# EAGLE design GPS Pro Mini Shield (EAGLE 7.6.0)
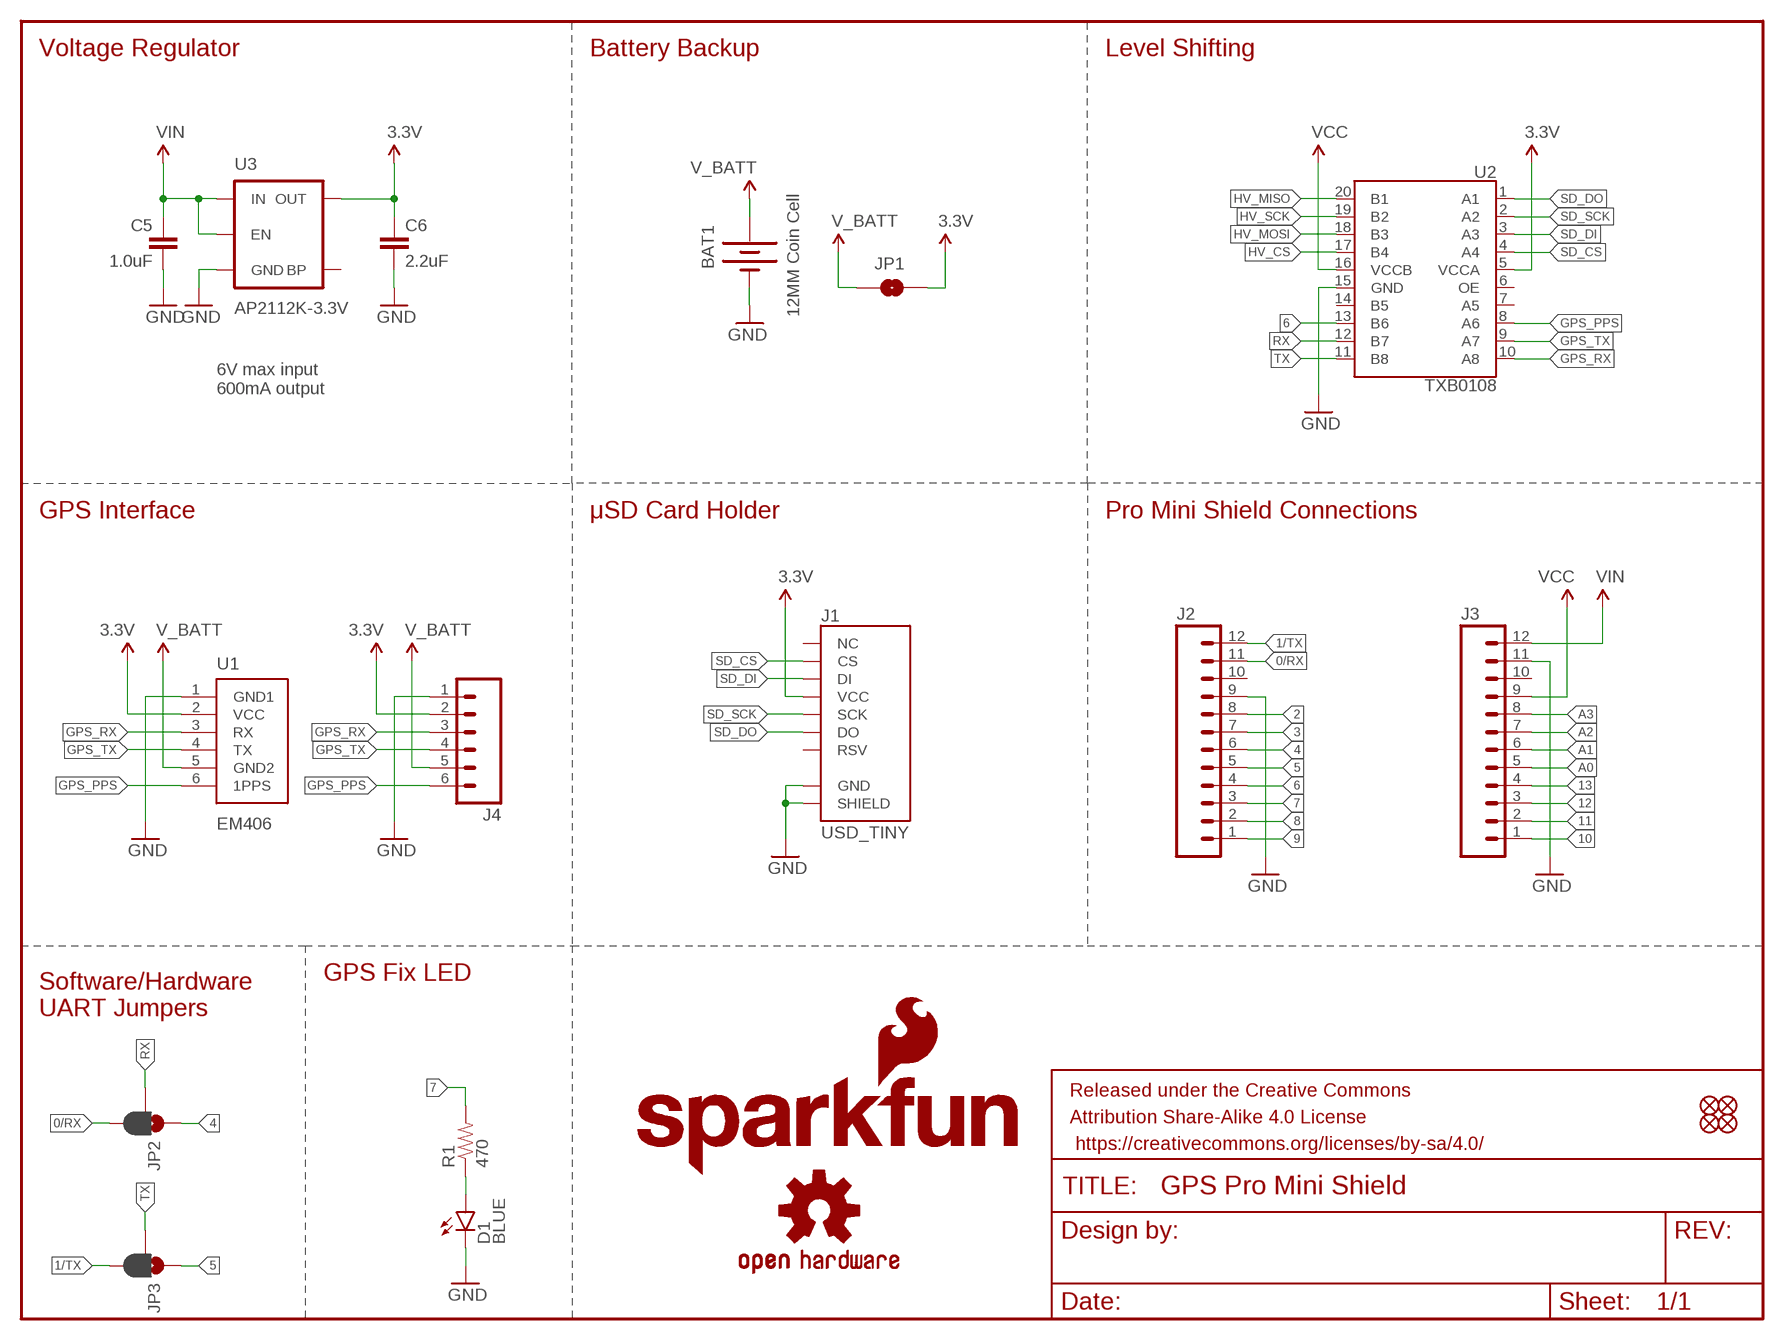
[diagram p0: schematic, sheet 1]

## Parts
BAT1  12MM Coin Cell  BATTERY12MM  [BATTCON_12MM]
C5  1.0uF  1.0UF-25V-+80/-20(0805)"  [0805-CAP]
C6  2.2uF  2.2UF-10V-20%(0603)  [0603-CAP]
D1  BLUE  LED-BLUE0603  [LED-0603]
FD1  FIDUCIALUFIDUCIAL  [MICRO-FIDUCIAL]
FD2  FIDUCIALUFIDUCIAL  [MICRO-FIDUCIAL]
FD3  FIDUCIALUFIDUCIAL  [MICRO-FIDUCIAL]
FD4  FIDUCIALUFIDUCIAL  [MICRO-FIDUCIAL]
FRAME1  FRAME-LETTER  [CREATIVE_COMMONS]
J1  USD_TINY  [SLIM_USD]
J2  M12NO_SILK  [1X12_NO_SILK]
J3  M12NO_SILK  [1X12_NO_SILK]
J4  M06NO_SILK_FEMALE_PTH  [1X06_NO_SILK]
JP1  JUMPER-PAD-2-NOYES_SILK  [PAD-JUMPER-2-NO_YES_SILK]
JP2  JUMPER-PAD-3-2OF3_NC_BY_PASTE  [PAD-JUMPER-3-2OF3_NC_BY_PASTE_YES_SILK_FULL_BOX]
JP3  JUMPER-PAD-3-2OF3_NC_BY_PASTE  [PAD-JUMPER-3-2OF3_NC_BY_PASTE_YES_SILK_FULL_BOX]
LOGO1  OSHW-LOGOS  [OSHW-LOGO-S]
LOGO3  SFE_LOGO_FLAME.1_INCH  [SFE_LOGO_FLAME_.1]
LOGO4  SFE_LOGO_NAME.1_INCH  [SFE_LOGO_NAME_.1]
R1  470  470OHM1/10W1%(0603)  [0603-RES]
U1  EM406  [EM406]
U2  TXB0108  [UFDFN-20]
U3  AP2112K-3.3V  V_REG_LDOSMD  [SOT23-5]

## Nets
0/RX: J2.11 JP2.3
1/TX: J2.12 JP3.3
2: J2.8
3: J2.7
3.3V: C6.1 J1.4(VCC) J4.2 JP1.2 U1.2(VCC) U2.5(VCCA) U3.5(OUT)
4: J2.6 JP2.1
5: J2.5 JP3.1
6: J2.4 U2.13(B6)
7: J2.3 R1.2
8: J2.2
9: J2.1
10: J3.1
11: J3.2
12: J3.3
13: J3.4
A0: J3.5
A1: J3.6
A2: J3.7
A3: J3.8
GND: BAT1.GND(-) C5.2 C6.2 D1.C J1.6(GND) J1.GND1(SHIELD) J1.GND2(SHIELD) J1.GND3(SHIELD) J1.GND4(SHIELD) J1.GND5(SHIELD) J1.GND6(SHIELD) J2.9 J3.11 J4.1 U1.1(GND1) U2.15(GND) U3.2(GND)
GPS_PPS: J4.6 U1.6(1PPS) U2.8(A6)
GPS_RX: J4.3 U1.3(RX) U2.10(A8)
GPS_TX: J4.4 U1.4(TX) U2.9(A7)
HV_CS: U2.17(B4)
HV_MISO: U2.20(B1)
HV_MOSI: U2.18(B3)
HV_SCK: U2.19(B2)
N$1: D1.A R1.1
RX: JP2.2 U2.12(B7)
SD_CS: J1.2(CS) U2.4(A4)
SD_DI: J1.3(DI) U2.3(A3)
SD_DO: J1.7(DO) U2.1(A1)
SD_SCK: J1.5(SCK) U2.2(A2)
TX: JP3.2 U2.11(B8)
V_BATT: BAT1.PWR@1(+) J4.5 JP1.1 U1.5(GND2)
VCC: J3.9 U2.16(VCCB)
VIN: C5.1 J3.12 U3.1(IN) U3.3(EN)
Unconnected: J1.1(RSV) J1.8(RSV) J1.9(NC) J2.10 J3.10 U2.6(OE) U2.7(A5) U2.14(B5) U3.4(BP)

## Notes on the sheet
- Voltage Regulator | Battery Backup | Level Shifting
- 6V max input
  600mA output
- GPS Interface | μSD Card Holder | Pro Mini Shield Connections
- GPS Fix LED
- Software/Hardware
  UART Jumpers

## Library data of the parts
BAT1 = SparkFun-Electromechanical:BATTERY: Battery Holders Various common sizes : AA, AAA, 18650 (PRT-12895), 20mm coin cell and 12mm coin cell. 20MM_4LEGS, BATT-10373; PROD_ID: BATT-08044
C5 = SparkFun-Capacitors:1.0UF-25V-+80/-20(0805): CAP-11625; PROD_ID: CAP-11625
C6 = SparkFun-Capacitors:2.2UF-10V-20%(0603): CAP-07888; PROD_ID: CAP-07888
D1 = SparkFun-LED:LED-BLUE: Blue LEDs for production use Various blue LEDs stocked by SparkFun production 0603 - DIO-08575 Rebel - DIO-09553 1206 - DIO-09911; PROD_ID: DIO-08575
FD1-FD4 = SparkFun-Aesthetics:FIDUCIAL: Fiducial Alignment Points Various fiducial points for machine vision alignment.
FRAME1 = SparkFun-Aesthetics:FRAME-LETTER: Schematic Frame Standard 8.5x11 US Letter frame
J1 = uSD Socket temp:USD_TINY
J2 J3 = SparkFun-Connectors:M12: Header 12 Standard 12-pin 0.1" header. Use with straight break away headers (SKU : PRT-00116), right angle break away headers (PRT-00553), swiss pins (PRT-00743), machine pins (PRT-00117), and female headers (PRT-00115).
J4 = SparkFun-Connectors:M06: Header 6 Standard 6-pin 0.1" header. Use with straight break away headers (SKU : PRT-00116), right angle break away headers (PRT-00553), swiss pins (PRT-00743), machine pins (PRT-00117), and female headers (PRT-00115). Molex polarized connector foot print use with SKU : PRT-08094 with associated crimp pins and housings. NOTES ON THE VARIANTS LOCK and LOCK_LONGPADS... This footprint was designed to help hold the alignment of a through-hole component (i.e. 6-pin header) while soldering it into place. You may notice that each hole has been shifted either up or down by 0.005 of an inch from it's more standard position (which is a perfectly straight line). This slight alteration caused the pins (the squares in the middle) to touch the edges of the holes. Because they are alternating, it causes a "brace" to hold the component in place. 0.005 has proven to be the perfect amount of "off-center" position when using our standard breakaway headers. Although looks a little odd when you look at the bare footprint, once you have a header in there, the alteration is very hard to notice. Also,if you push a header all the way into place, it is covered up entirely on the bottom side. This idea of altering the position of holes to aid alignment will be further integrated into the Sparkfun Library for other footprints. It can help hold any component with 3 or more connection pins.; PROD_ID: CONN-08437
JP1 = SparkFun-Passives:JUMPER-PAD-2-NO
JP2 JP3 = SparkFun-Passives:JUMPER-PAD-3-2OF3_NC_BY_PASTE
LOGO1 = SparkFun-Aesthetics:OSHW-LOGO: Open Source Hardware Logo This logo indicates the piece of hardware it is found on incorporates a OSHW license and/or adheres to the definition of open source hardware found here: http://freedomdefined.org/OSHW
LOGO3 = SparkFun-Aesthetics:SFE_LOGO_FLAME: SFE Logo, flame only This is the SparkFun flame logo. The logo on the schematic will always be the same size; the package variant is the height of the flame. Default layer for the logo on the board is tSilk.
LOGO4 = SparkFun-Aesthetics:SFE_LOGO_NAME: SFE Logo, name only This is the SparkFun name logo. The logo on the schematic will always be the same size; the package variant is the height of the flame part of the logo (or the height the flame would be, if it were drawn). Default layer for the logo on the board is tSilk.
R1 = SparkFun-Resistors:470OHM1/10W1%(0603): RES-07869; PROD_ID: RES-07869
U1 = SparkFun-Connectors:EM406: EM406 GPS Connector Proven layout and schematic for EM406 connector. Spark Fun Electronics SKU : GPS-00579
U2 = SparkFun-DigitalIC:TXB0108: 8-Bit Bi-Directional Level Shifter 1.2V-3.6V (VCCA) to 1.65V-5.5V (VCCB) bi-directional level shifter with auto direction sensing. Max data rate - VCCA 1.2V: 20Mbps (50ns), VCCA 3.3V: 100Mbps (10ns) Digikey: 296-27217-1-ND (20-UFDFN) IC-12292; PROD_ID: IC-12292
U3 = SparkFun-PowerIC:V_REG_LDO: Voltage Regulator LDO Standard 150mA LDO voltage regulator in SOT-23 layout. Micrel part MIC5205. BP (by-pass) pin is used to lower output noise with 470pF cap.; PROD_ID: VREG-12457

## Board
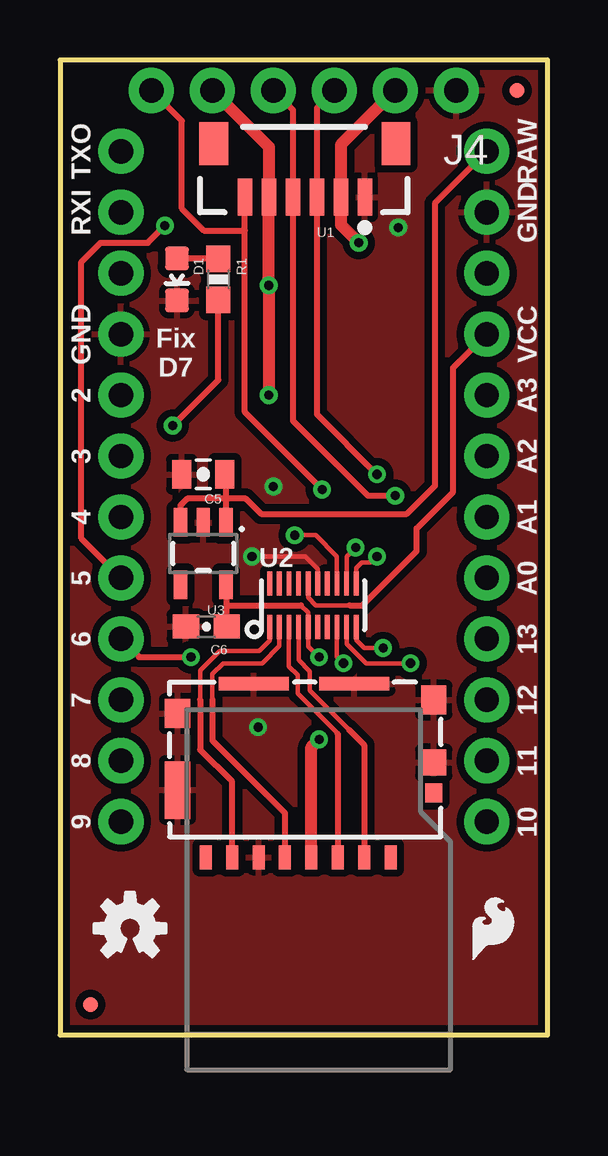
[diagram p1: board, top side]
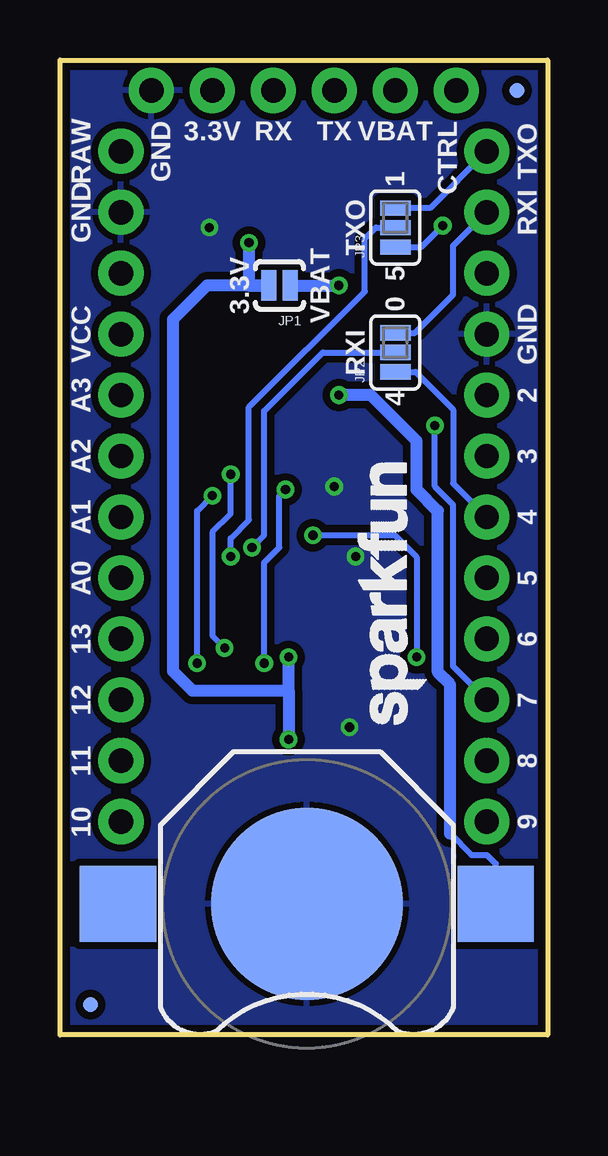
[diagram p2: board, bottom side, seen from below]

Size 20.32 x 40.64 mm. Coordinates in mm from the lower left corner, seen from the top.
Outline: 0,0 20.32,0 20.32,40.64 0,40.64 0,0
Copper layers (1*16): Top 0.035mm / dielectric 1.5mm / Bottom 0.035mm
Design rules "SparkFun-2-layer-TIGHT": minimum track width 7mil, minimum drill 15mil, track to track 7mil, track to pad 7mil, pad to pad 7mil, via to via 7mil, smd to smd 7mil, copper to edge 7mil, drill to drill 7mil, minimum pad ring 7mil, minimum via ring 7mil, stop-mask expansion 4mil, vias tented up to drill 25mil, thermal gap 10mil

### Footprints (pad centres in the part's own frame; a part is rotated, then mirrored left to right if it is on the bottom)
BATTCON_12MM = smd 8 x 8: GND 0,0 | smd 3.175 x 3.175: PWR@1 -7.874,0; PWR@2 7.874,0
0805-CAP = smd 0.8 x 1.2: 1 -0.9,0; 2 0.9,0
0603-CAP = smd 1.1 x 1: 1 -0.85,0; 2 0.85,0
LED-0603 = smd 1 x 1: A 0,-0.877; C 0,0.877
MICRO-FIDUCIAL = smd 0.635 x 0.635: 1 0,0
SLIM_USD = smd 0.5 x 1: 1 9.2,-0.85; 2 8.1,-0.85; 3 7,-0.85; 4 5.9,-0.85; 5 4.8,-0.85; 6 3.7,-0.85; 7 2.6,-0.85; 8 1.5,-0.85 | smd 0.72 x 0.78: 9 11,1.83 | smd 1.05 x 1.08: GND1 11,3.1 | smd 1.05 x 1.2: GND2 11,5.71; GND3 0.325,5.14 | smd 1.05 x 2.39: GND4 0.325,1.955 | smd 2.91 x 0.55: GND5 3.505,6.385; GND6 7.695,6.385
1X12_NO_SILK = drill 1.016 pad 1.88: 1 0,0; 2 2.54,0; 3 5.08,0; 4 7.62,0; 5 10.16,0; 6 12.7,0; 7 15.24,0; 8 17.78,0; 9 20.32,0; 10 22.86,0; 11 25.4,0; 12 27.94,0
1X06_NO_SILK = drill 1.016 pad 1.88: 1 0,0; 2 2.54,0; 3 5.08,0; 4 7.62,0; 5 10.16,0; 6 12.7,0
PAD-JUMPER-2-NO_YES_SILK = smd 0.635 x 1.27: 1 -0.45,0; 2 0.45,0
PAD-JUMPER-3-2OF3_NC_BY_PASTE_YES_SILK_FULL_BOX = smd 0.635 x 1.27: 1 -0.813,0; 2 0,0; 3 0.813,0
0603-RES = smd 1.1 x 1: 1 -0.85,0; 2 0.85,0
EM406 = smd 0.6 x 1.55: 1 0,0; 2 1,0; 3 2,0; 4 3,0; 5 4,0; 6 5,0 | smd 1.2 x 1.8: P$1 -1.3,-2.225; P$2 6.3,-2.225
UFDFN-20 = smd 0.2 x 1: 1 -1.8,-0.9; 2 -1.4,-0.9; 3 -1,-0.9; 4 -0.6,-0.9; 5 -0.2,-0.9; 6 0.2,-0.9; 7 0.6,-0.9; 8 1,-0.9; 9 1.4,-0.9; 10 1.8,-0.9; 11 1.8,0.9; 12 1.4,0.9; 13 1,0.9; 14 0.6,0.9; 15 0.2,0.9; 16 -0.2,0.9; 17 -0.6,0.9; 18 -1,0.9; 19 -1.4,0.9; 20 -1.8,0.9
SOT23-5 = smd 0.55 x 1.2: 1 -0.95,-1.3; 2 0,-1.3; 3 0.95,-1.3; 4 0.95,1.3; 5 -0.95,1.3

### Placement (x,y rotation side)
BAT1  10.03,5.46 180 bottom
C5  5.97,23.37 180 top
C6  6.1,17.02 180 top
D1  4.88,31.5 180 top
FD1  1.27,1.27 0 top
FD2  19.05,39.37 0 top
FD3  19.05,1.27 0 bottom
FD4  1.27,39.37 0 bottom
FRAME1  -23.7,-17.37 0 top  (outside the outline)
J1  4.57,8.26 0 top
J2  2.54,8.89 90 top
J3  17.78,8.89 90 top
J4  16.51,39.37 180 top
JP1  11.18,31.24 180 bottom
JP2  6.35,28.45 90 bottom
JP3  6.35,33.66 90 bottom
LOGO1  2.92,4.45 0 top
LOGO3  16.89,2.79 0 top
LOGO4  4.57,12.45 90 bottom
R1  6.6,31.5 270 top
U1  12.7,34.92 180 top
U2  10.54,17.91 0 top
U3  5.97,20.07 180 top

### Tracks (layer width: path | path; a pad name or v marks a point on that pad's centre or on a via)
0/RX
  Bottom 0.254: JP2.3 5.53,29.26 3.94,30.86 3.94,32.89 J2.11
1/TX
  Bottom 0.254: J2.12 4.9,34.47 JP3.3
3.3V  (via drill 0.38)
  Top 0.178: v10.79,15.75 10.34,16.2 U2.5 10.34,17.6 10.03,17.91
  Top 0.254: C6.1 6.95,17.91 | 6.95,17.91 6.95,18.77 U3.5 | 6.95,17.91 10.03,17.91
  Top 0.508: J4.2 11.7,37.1 U1.2 11.7,33.77 v12.45,33.02 | J1.4 10.47,12 v10.79,12.32
  Bottom 0.508: v12.45,33.02 12.45,31.24 JP1.2 14.2,31.24 15.62,29.82 15.62,15.16 14.81,14.35 10.79,14.35 | 10.79,14.35 v10.79,15.75 | 10.79,14.35 v10.79,12.32
4
  Bottom 0.254: JP2.1 5.5,27.64 3.94,26.07 3.94,22.99 J2.6
5  (via drill 0.38)
  Top 0.254: J2.5 0.89,20.7 0.89,32.22 1.69,33.02 3.66,33.02 v4.37,33.73
  Bottom 0.254: JP3.1 5.26,32.84 v4.37,33.73
6  (via drill 0.38)
  Top 0.178: v9.78,20.83 10.65,20.83 11.54,19.94 U2.13
  Top 0.254: J2.4 3.3,15.75 v5.46,15.75
  Bottom 0.254: v9.78,20.83 6.38,20.83 5.46,19.91 v5.46,15.75
7  (via drill 0.38)
  Top 0.254: v4.7,25.4 6.6,27.3 R1.2
  Bottom 0.254: J2.3 3.94,15.37 3.94,22.1 4.7,22.86 v4.7,25.4
GND  (via drill 0.38)
  Top 0.178: U2.15 10.74,19.42 10.22,19.94 v8,19.94
  other vias: 14.1,33.66 8.26,12.83 8.89,22.86
  pour Top (isolate 0.305): 0,40.64 0,0 20.32,0 20.32,40.64
  pour Bottom (isolate 0.305): 20.32,40.64 20.32,0 0,0 0,40.64
GPS_PPS  (via drill 0.38)
  Top 0.178: U2.8 11.54,15.76 v11.81,15.49
  Top 0.254: J4.6 5.08,38.1 5.08,34.44 6,33.53 7.7,33.53 | 7.7,33.53 U1.6 | v10.92,22.73 7.7,25.95 7.7,33.53
  Bottom 0.254: v11.81,15.49 11.81,19.68 11.18,20.32 11.18,22.48 v10.92,22.73
GPS_RX  (via drill 0.38)
  Top 0.178: U2.10 12.34,16.47 12.69,16.13 v13.46,16.13
  Top 0.254: J4.3 10.7,38.64 U1.3 10.7,25.88 v13.21,23.37
  Bottom 0.254: v13.46,16.13 13.97,16.64 13.97,20.95 13.21,21.72 v13.21,23.37
GPS_TX  (via drill 0.38)
  Top 0.178: U2.9 11.94,16.3 12.75,15.49 v14.61,15.49
  Top 0.254: J4.4 9.7,38.56 U1.4 9.7,25.61 12.83,22.48 v13.97,22.48
  Bottom 0.254: v14.61,15.49 14.61,21.84 v13.97,22.48
N$1
  Top 0.254: D1.A 6.58,32.37 R1.1
RX  (via drill 0.38)
  Top 0.178: U2.12 11.94,19.94 v12.32,20.32
  Bottom 0.254: v12.32,20.32 11.81,20.83 11.81,26 9.37,28.45 JP2.2
SD_CS
  Top 0.178: U2.4 9.94,15.62 10.41,15.15 10.41,14.35 12.04,12.72
  Top 0.254: 12.04,12.72 12.67,12.09 J1.2
SD_DI
  Top 0.178: U2.3 9.54,15.37 9.91,15 9.91,14.23 11.57,12.57
  Top 0.254: 11.57,12.57 J1.3
SD_DO
  Top 0.178: U2.1 8.74,16.44 8.3,16 6.66,16 5.84,15.19 5.84,13.98
  Top 0.254: 5.84,13.98 5.84,11.89 7.17,10.56 J1.7
SD_SCK
  Top 0.178: U2.2 9.14,16.21 8.43,15.49 6.81,15.49 6.35,15.04 6.35,13.98
  Top 0.254: 6.35,13.98 6.35,12.27 9.37,9.25 J1.5
TX  (via drill 0.38)
  Top 0.178: U2.11 12.34,19.45 12.57,19.68 12.95,19.68 v13.21,19.94
  Bottom 0.254: v13.21,19.94 13.21,20.7 12.45,21.46 12.45,26.16 7.62,30.99 7.62,33.2 7.16,33.66 JP3.2
V_BATT  (via drill 0.38)
  Top 0.508: v8.7,26.67 v8.7,31.24 U1.5 8.7,37.02 J4.5
  Bottom 0.254: BAT1.PWR@1 2.16,7.13 2.52,7.49 3.17,7.49 4.06,8.39
  Bottom 0.508: JP1.1 v8.7,31.24 | 4.06,8.39 4.06,14.61 4.57,15.11 4.57,21.84 5.46,22.73 5.46,24.77 7.37,26.67 v8.7,26.67
VCC
  Top 0.178: U2.16 10.34,18.23 10.66,17.91 12.06,17.91
  Top 0.254: J3.9 16.38,27.81 16.38,22.64 14.86,21.11 14.86,20.17 12.6,17.91 12.06,17.91
VIN
  Top 0.254: U3.1 6.92,22.35 | 6.92,22.35 6.92,23.37 C5.1 | J3.12 15.62,34.67 15.62,22.89 14.45,21.72 8.38,21.72 7.75,22.35 6.92,22.35 | 6.92,22.35 5.3,22.35 5.02,22.07 U3.3

### Text on the board
tPlace: TXO | RAW | RXI | GND | GND | Fix / D7 | VCC | 2 | A3 | 3 | A2 | 4 | A1 | 5 | A0 | 6 | 13 | 7 | 12 | 8 | 11 | 9 | 10
bPlace: CTRL | VBAT | TX | RX | 3.3V | GND | TXO | RAW | 1 | RXI | TXO | GND | 5 | VBAT | 3.3V | 0 | GND | VCC | RXI | 2 | 4 | A3 | 3 | A2 | 4 | A1 | 5 | A0 | 6 | 13 | 7 | 12 | 8 | 11 | 9 | 10
tDocu: Alex Wende